# Altium schematic sheet Sheet1.SchDoc
size A; SheetNumber: 1; SheetTotal: 1
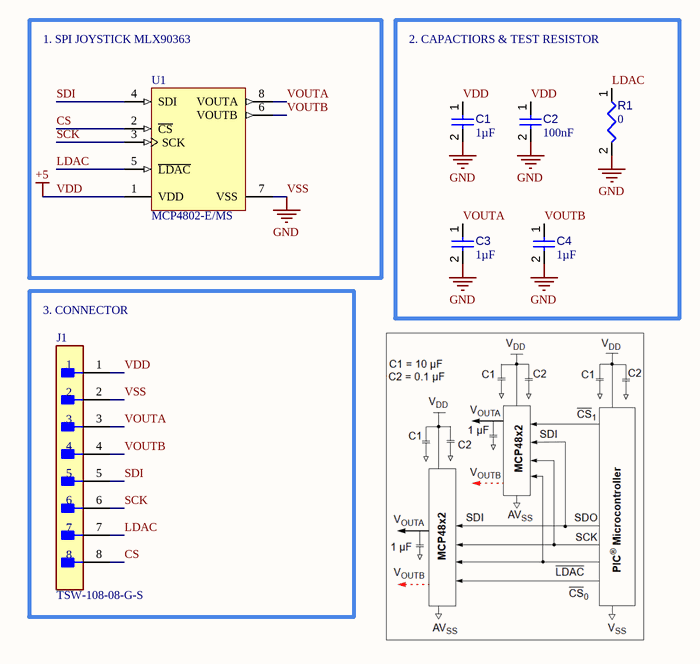
[diagram p0: Sheet1.SchDoc]

## Parts
C1  value 1µF  [CAPC0402(1005)60_L]  (hidden comment: Capacitor 1µF +/-20% 10V 0402)
C2  value 100nF  [CAPC0402(1005)60_L]  (hidden comment: Capacitor 100nF +/-20% 25V 0402)
C3  value 1µF  [CAPC0402(1005)60_L]  (hidden comment: Capacitor 1µF +/-20% 10V 0402)
C4  value 1µF  [CAPC0402(1005)60_L]  (hidden comment: Capacitor 1µF +/-20% 10V 0402)
J1  TSW-108-08-G-S  [FP-TSW-108-08-G-S-MFG]
R1  value 0  [RESC0402(1005)_L]  (hidden comment: 0R2J)
U1  MCP4802-E/MS  [MSOP-MS8_N]

## Blocks framed on the sheet
1. SPI JOYSTICK MLX90363: U1
2. CAPACTIORS & TEST RESISTOR: C1-C4 R1
3. CONNECTOR: J1

## Nets
VDD: C1.1 C2.1 J1.1 U1.1(VDD)  [also labelled +5]
VSS: C1.2 C2.2 C3.2 C4.2 J1.2 R1.2 U1.7(VSS)  [also labelled GND]
CS: J1.8 U1.2(~{CS})
LDAC: J1.7 R1.1 U1.5(~{LDAC})
SCK: J1.6 U1.3(SCK)
SDI: J1.5 U1.4(SDI)
VOUTA: C3.1 J1.3 U1.8(VOUTA)
VOUTB: C4.1 J1.4 U1.6(VOUTB)

## Library data of the parts
C1 C3 C4 = CMP-001-00063-3: Chip Capacitor, 1µF +/-20%, 10V, 0402, Thickness 0.6 mm; Tolerance: 10%; Mounting Technology: SMT; Max Operating Temperature: 85°C; Voltage Rating: 10V; Pins: 2; Case/Package: 0402; Min Operating Temperature: -55°C
C2 = CMP-001-00065-4: Chip Capacitor, 100nF +/-20%, 25V, 0402, Thickness 0.6 mm; Tolerance: 10%; Max Operating Temperature: 85°C; Min Operating Temperature: -55°C; Pins: 2; Voltage Rating: 25V; Mounting Technology: SMT; Case/Package: 0402
J1 = CMP-002-00076-1: TSW - Samtec 2.54mm Pin Header 13.46mm Overall Pin Length 5.08mm Tail (08) (mcv)(TO22); Max Current Rating: 7.6A; Number of Positions: 8; Gender: Male; Max Voltage Rating (AC): 550V; Depth: 2.54mm; Max Operating Temperature: 125°C; Series: TSW; Lead Free: Lead Free; Orientation: Straight; Contact Material: Bronze; Mounting Technology: Through Hole; Packaging: Bulk; Termination: Solder; Contact Mating Length: 0.23inch; Reach SVHC Compliant: No; Housing Material: Polyester; Number of Contacts: 8; RoHS Compliant: Yes; Contact Type: Male Pin; Min Operating Temperature: -55°C; Color: Black; Contact Plating: Gold; Radiation Hardening: No; Pitch: 2.54mm; Width: 2.54mm; Length: 20.32mm; Housing Color: Black; Number of Rows: 1
R1 = CMP-009-00062-2: Jumper 0402 (1005 Metric); Pins: 2; Mounting Technology: SMT; Case/Package: 0402
U1 = CMP-001-0001-1: DAC 2-CH Resistor-String 8-bit Automotive 8-Pin MSOP Tube; Interface: SPI,Serial,3-WIRE; Reference Voltage: 2.048V; Output Type: Voltage; Input Offset Voltage (Vos): 820uV; Min Supply Voltage: 2.7V; Settling Time: 4.5us; Resolution: 8b; Number of DAC Channels: 2; Supply Current: 415uA; Number of Converters: 1; Number of Bits: 8; Max Supply Voltage: 5.5V; Integral Nonlinearity (INL): 1LSB; Operating Supply Voltage: 5V; Output Polarity: Bipolar; Package Quantity: 100; Packaging: Rail/Tube; Radiation Hardening: No; Max Operating Temperature: 125°C; Reach SVHC Compliant: No; Lead Free: Lead Free; Number of Channels: 2; Mounting Technology: Surface Mount; RoHS Compliant: Yes; Width: 3mm; Length: 3mm; Min Operating Temperature: -40°C; Height: 0.95mm; Case/Package: MSOP; Pins: 8